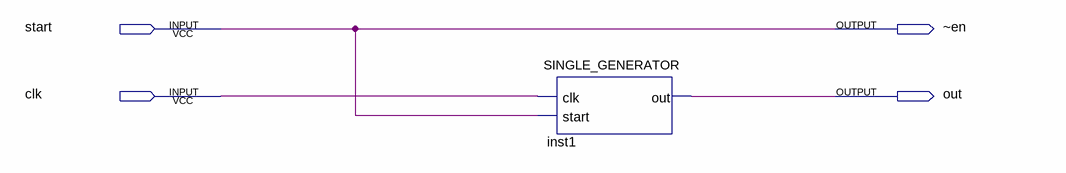
[diagram p0: schematic sheet]
// Quartus schematic SINGLE_GENERATOR_SHM.bdf as structural Verilog: 1 symbols, 4 pins
module SINGLE_GENERATOR_SHM (
  input  start,
  input  clk,
  output \~en ,
  output out
);

  SINGLE_GENERATOR inst1 (.clk(clk), .start(start), .out(out));

  assign \~en  = start;
endmodule
